# Altium project PCB_Project1.PrjPCB
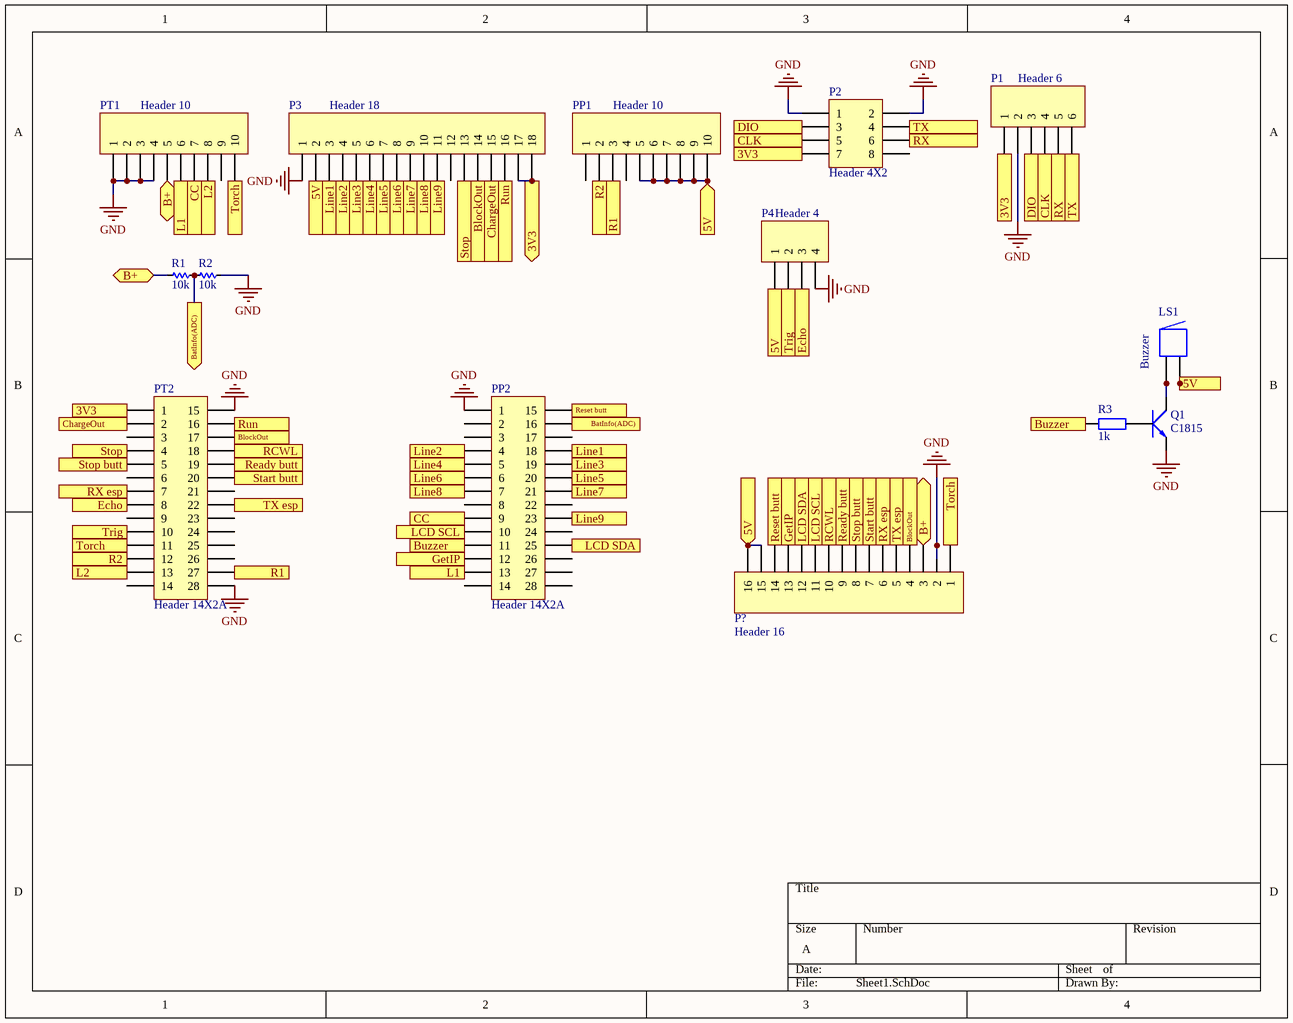
[diagram p0: Sheet1.SchDoc]
1 sheet, 14 parts. Net scope: flat (ports and power ports of the same name join across sheets).
Board file: PCB1.PcbDoc

## Sheet Sheet1.SchDoc
size A

### Parts
LS1  Buzzer  [ABSM-1574]
P1  Header 6  [HDR1X6]
P2  Header 4X2  [HDR2X4]
P3  Header 18  [HDR1X18]
P4  Header 4  [HDR1X4]
P?  Header 16  [HDR1X16]
PP1  Header 10  [HDR1X10]
PP2  Header 14X2A  [HDR2X14_CEN]
PT1  Header 10  [HDR1X10]
PT2  Header 14X2A  [HDR2X14_CEN]
Q1  C1815  [QTO-92]
R1  10k  [RES-1/4W]
R2  10k  [RES-1/4W]
R3  1k  [R1/4W]

### Ports
3V3, 3V3 (out), 5V, 5V (in), B+ (bidir), BatInfo(ADC) (out), BlockOut (out), Buzzer, CC (in), ChargeOut (out), CLK, DIO, Echo, GetIP, L1, L2, LCD SCL, LCD SDA, Line1 (out), Line2 (out), Line3 (out), Line4 (out), Line5 (out), Line6 (out), Line7 (out), Line8 (out), Line9 (out), R1, R2, RCWL, Ready butt, Reset butt, Run (in), RX, RX esp, Start butt, Stop (in), Stop butt, Torch (in), Torch (out), Trig, TX, TX esp

### Nets
GND: P1.2 P2.1 P2.2 P3.1 P4.4 P?.2 PP2.1 PT1.1 PT1.2 PT1.3 PT1.4 PT2.15 PT2.28 Q1.1(E) R2.2
NetLS1_1: LS1.1 LS1.1A Q1.2(C)
NetLS1_2: LS1.2 LS1.2A P3.2 P4.1 P?.15 P?.16 PP1.5 PP1.6 PP1.7 PP1.8 PP1.9 PP1.10 ; port 5V
NetP1_1: P1.1 P2.7 P3.17 P3.18 PT2.1 ; port 3V3
NetP1_3: P1.3 P2.3 ; port DIO
NetP1_4: P1.4 P2.5 ; port CLK
NetP1_5: P1.5 P2.6 ; port RX
NetP1_6: P1.6 P2.4 ; port TX
NetP3_3: P3.3 PP2.18 ; port Line1
NetP3_4: P3.4 PP2.4 ; port Line2
NetP3_5: P3.5 PP2.19 ; port Line3
NetP3_6: P3.6 PP2.5 ; port Line4
NetP3_7: P3.7 PP2.20 ; port Line5
NetP3_8: P3.8 PP2.6 ; port Line6
NetP3_9: P3.9 PP2.21 ; port Line7
NetP3_10: P3.10 PP2.7 ; port Line8
NetP3_11: P3.11 PP2.23 ; port Line9
NetP3_13: P3.13 PT2.4 ; port Stop
NetP3_14: P3.14 P?.4 PT2.17 ; port BlockOut
NetP3_15: P3.15 PT2.2 ; port ChargeOut
NetP3_16: P3.16 PT2.16 ; port Run
NetP4_2: P4.2 PT2.10 ; port Trig
NetP4_3: P4.3 PT2.8 ; port Echo
NetP?_1: P?.1 PT1.10 PT2.11 ; port Torch
NetP?_3: P?.3 PT1.5 R1.2 ; port B+
NetP?_5: P?.5 PT2.22 ; port TX esp
NetP?_6: P?.6 PT2.7 ; port RX esp
NetP?_7: P?.7 PT2.20 ; port Start butt
NetP?_8: P?.8 PT2.5 ; port Stop butt
NetP?_9: P?.9 PT2.19 ; port Ready butt
NetP?_10: P?.10 PT2.18 ; port RCWL
NetP?_11: P?.11 PP2.10 ; port LCD SCL
NetP?_12: P?.12 PP2.25 ; port LCD SDA
NetP?_13: P?.13 PP2.12 ; port GetIP
NetP?_14: P?.14 PP2.15 ; port Reset butt
NetPP1_2: PP1.2 PT2.12 ; port R2
NetPP1_3: PP1.3 PT2.27 ; port R1
NetPP2_9: PP2.9 PT1.7 ; port CC
NetPP2_11: PP2.11 R3.1 ; port Buzzer
NetPP2_13: PP2.13 PT1.6 ; port L1
NetPP2_16: PP2.16 R1.1 R2.1 ; port BatInfo(ADC)
NetPT1_8: PT1.8 PT2.13 ; port L2
NetQ1_3: Q1.3(B) R3.2

Not connected (* = marked no-connect by the designer): P2 8; P3 12; PP1 1 4; PP2 2 3 8 14 17 22 24 26 27 28; PT1 9; PT2 3 6 9 14 21 23 24 25 26

### Library data of the parts
LS1 = Buzzer: Magnetic Transducer Buzzer; Published: 24-Mar-1999; LatestRevisionDate: 17-Dec-2003; LatestRevisionNote: Schematic revised, PCB Footprint replaced.; DatasheetVersion: 17-Dec-2003; PackageReference: ABSM-1574; Publisher: Altium Limited; PackageDescription: Magnetic Transducer Buzzer; ComponentLink1Description: Manufacturer Link; ComponentLink1URL: http://www.megastar.com/linecard/buzzmode/index.php
P1 = Header 6: Header, 6-Pin; LatestRevisionDate: 17-Jul-2002; LatestRevisionNote: Re-released for DXP Platform.; Publisher: Altium Limited
P2 = Header 4X2: Header, 4-Pin, Dual row; LatestRevisionDate: 17-Jul-2002; LatestRevisionNote: Re-released for DXP Platform.; Publisher: Altium Limited
P3 = Header 18: Header, 18-Pin; LatestRevisionDate: 17-Jul-2002; LatestRevisionNote: Re-released for DXP Platform.; Publisher: Altium Limited
P4 = Header 4: Header, 4-Pin; LatestRevisionDate: 17-Jul-2002; LatestRevisionNote: Re-released for DXP Platform.; Publisher: Altium Limited
P? = Header 16: Header, 16-Pin; LatestRevisionDate: 17-Jul-2002; LatestRevisionNote: Re-released for DXP Platform.; Publisher: Altium Limited
PP1 PT1 = Header 10: Header, 10-Pin; LatestRevisionDate: 17-Jul-2002; LatestRevisionNote: Re-released for DXP Platform.; Publisher: Altium Limited
PP2 PT2 = Header 14X2A: Header, 14-Pin, Dual row; LatestRevisionDate: 17-Jul-2002; LatestRevisionNote: Re-released for DXP Platform.; Publisher: Altium Limited
Q1 = C1815: NPN 600mW, ECB; Value: C1815
R1 R2 = Res: Manufacturer: Generic Components; Class: Passive; SubClass: R; Published: 08/06/2000; Publisher: Altium Hobart Technology Centre
R3 = R1/4W: Resistor 1/4W; Value: R1/4W - 1K